# Altium schematic sheet Stepper_driver.SchDoc
size A
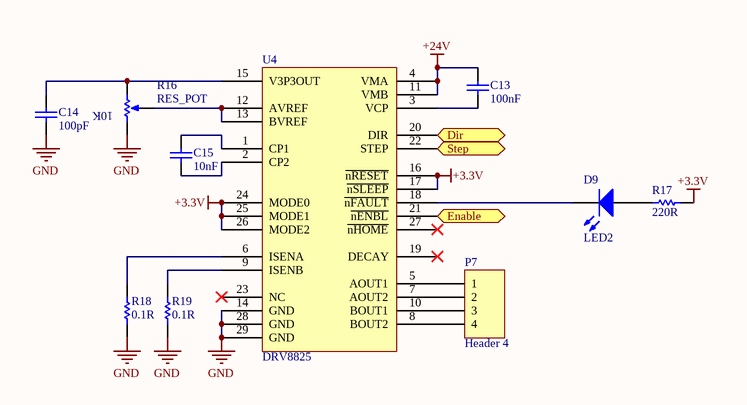
[diagram p0: Stepper_driver.SchDoc]

## Parts
C13  value 100nF  [1608[0603]]  (hidden comment: Cap)
C14  value 100pF  [1608[0603]]  (hidden comment: Cap)
C15  value 10nF  [1608[0603]]  (hidden comment: Cap)
D9  LED2  [LED 0805]
P7  Header 4  [HDR1X4]
R16  RES_POT  [RES_SMD]
R17  value 220R  [J1-0603]  (hidden comment: Res)
R18  value 0.1R  [C1206]  (hidden comment: Res)
R19  value 0.1R  [C1206]  (hidden comment: Res)
U4  DRV8825  [DVR]

## Ports
Dir, Enable, Step

## Nets
+3.3V: R17.2 U4.16(~{nRESET}) U4.17(~{nSLEEP}) U4.24(MODE0) U4.25(MODE1) U4.26(MODE2)
+24V: C13.2 U4.4(VMA) U4.11(VMB)
GND: C14.2 R16.1(TOP) R18.1 R19.1 U4.14(GND) U4.28(GND) U4.29(GND)
Dir: U4.20(DIR) ; port Dir
Enable: U4.21(~{nENBL}) ; port Enable
Step: U4.22(STEP) ; port Step
NetC13_1: C13.1 U4.3(VCP)
NetC14_1: C14.1 R16.2(BOT) U4.15(V3P3OUT)
NetC15_1: C15.1 U4.2(CP2)
NetC15_2: C15.2 U4.1(CP1)
NetD9_1: D9.1(A) R17.1
NetD9_2: D9.2(K) U4.18(~{nFAULT})
NetP7_1: P7.1 U4.5(AOUT1)
NetP7_2: P7.2 U4.7(AOUT2)
NetP7_3: P7.3 U4.10(BOUT1)
NetP7_4: P7.4 U4.8(BOUT2)
NetR16_3: R16.3(TAP) U4.12(AVREF) U4.13(BVREF)
NetR18_2: R18.2 U4.6(ISENA)
NetR19_2: R19.2 U4.9(ISENB)

Not connected (* = marked no-connect by the designer): U4 19(DECAY)* 23(NC)* 27(~{nHOME})*

## Notes on the sheet
- (in symbol RES_POT) 10K

## Library data of the parts
C13-C15 = Cap: Capacitor; Published: 8-Jun-2000; LatestRevisionDate: 17-Jul-2002; LatestRevisionNote: Re-released for DXP Platform.; PackageReference: RAD-0.3; Publisher: Altium Limited; PackageDescription: Radial Cap, Thru-Hole; 2 Leads; 0.3 in Pin Spacing
D9 = LED2: Typical RED, GREEN, YELLOW, AMBER GaAs LED; Published: 8-Jun-2000; LatestRevisionDate: 17-Jul-2002; LatestRevisionNote: Re-released for DXP Platform.; PackageVersion: Feb-2002; PackageReference: 3.2X1.6X1.1; Publisher: Altium Limited; PackageDescription: SM LED; 2 Flat Leads
P7 = Header 4: Header, 4-Pin; LatestRevisionDate: 17-Jul-2002; LatestRevisionNote: Re-released for DXP Platform.; Publisher: Altium Limited
R17-R19 = Res: Resistor 0805; Published: 8-Jun-2000; LatestRevisionDate: 17-Jul-2002; LatestRevisionNote: Re-released for DXP Platform.; PackageReference: AXIAL-0.3; Publisher: Altium Limited; PackageDescription: Axial Device, Thru-Hole; 2 Leads; 0.3 in Pin Spacing